# EasyEDA Pro project pcb工程文件.epro, schematic _bat-1
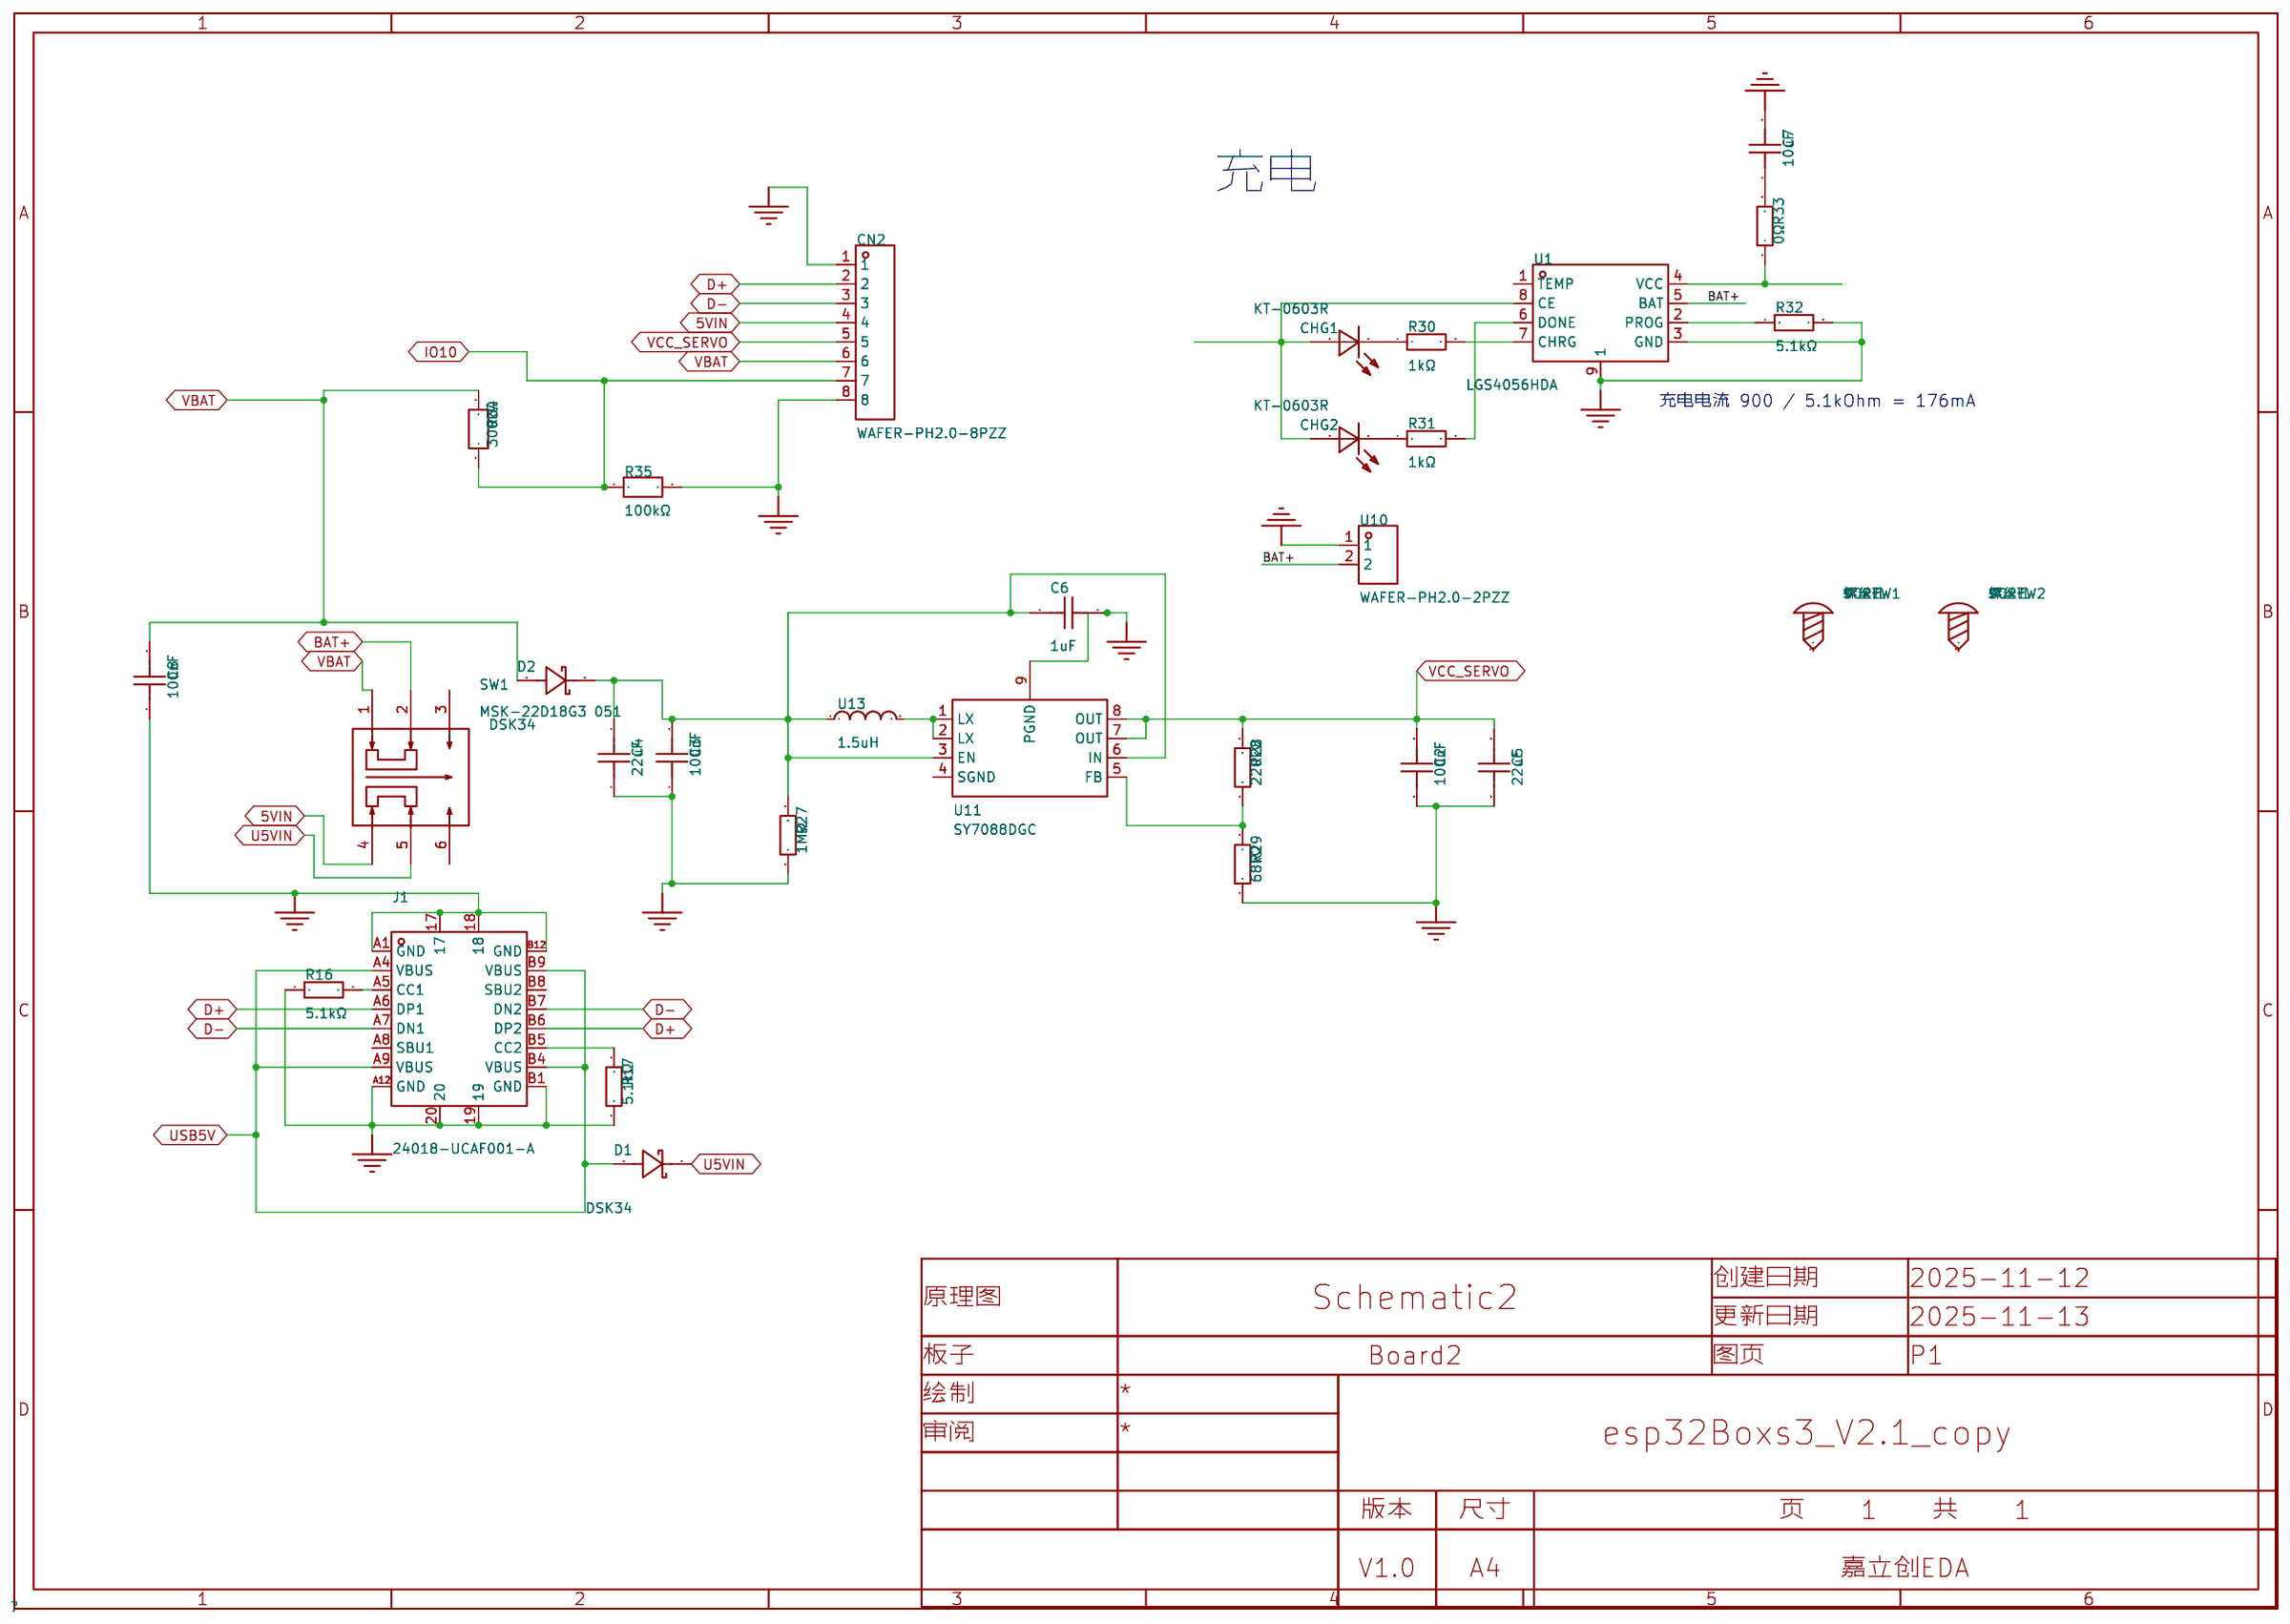
[diagram p1: schematic sheet]

## Parts
C2  100nF  [C0603]
C3  100nF  [C0603]
C4  22uF  [C0603]
C5  22uF  [C0603]
C6  1uF  [C0603]
C7  10uF  [C0603]
C8  100nF  [C0603]
CHG1  KT-0603R  [LED0603-RD]
CHG2  KT-0603R  [LED0603-RD]
CN2  WAFER-PH2.0-8PZZ  [CONN-TH_8P-P2.00_HDGC2001WV-8P]
D1  DSK34  [SOD-123FL_L2.7-W1.8-LS3.8-RD]
D2  DSK34  [SOD-123FL_L2.7-W1.8-LS3.8-RD]
J1  24018-UCAF001-A  [TYPE-C-USB-SMD_CF003]
R16  5.1kΩ  [R0603]
R17  5.1kΩ  [R0603]
R27  1MΩ  [R0603]
R28  220kΩ  [R0603]
R29  68kΩ  [R0603]
R30  1kΩ  [R0603]
R31  1kΩ  [R0603]
R32  5.1kΩ  [R0603]
R33  0Ω  [R0603]
R34  300kΩ  [R0603]
R35  100kΩ  [R0603]
SCREW1  螺丝孔  [M2螺丝]
SCREW2  螺丝孔  [M2螺丝]
SW1  MSK-22D18G3 051  [SW-TH_HX-MSK-22D18G3-051]
U1  LGS4056HDA  [DFN-8_L2.0-W2.0-P0.50-TL-EP1.6]
U10  WAFER-PH2.0-2PZZ  [CONN-TH_2P-P2.00_HC-PH-2A-M]
U11  SY7088DGC  [DFN-8_L3.0-W2.0-P0.50-BL-EP]
U13  1.5uH  [IND-SMD_L2.5-W2.0_FTC252010S]

## Library data of the parts
C2 C3 C8 = CC0603KRX7R9BB104: 容值:100nF;精度:±10%;额定电压:50V;温度系数:X7R;; LCSC Part Name: 100nF ±10% 50V; Supplier Part: C14663; Manufacturer: YAGEO(国巨); Supplier Footprint: 0603; JLCPCB Part Class: 基础库; Datasheet: https://item.szlcsc.com/datasheet/CC0603KRX7R9BB104/15331.html; Supplier: LCSC; Tolerance: ±10%; Voltage Rating: 50V; Temperature Coefficient: X7R
C4 C5 = CL10A226MQ8NRNC: 容值:22uF;精度:±20%;额定电压:6.3V;温度系数:X5R;; LCSC Part Name: 22uF ±20% 6.3V; Supplier Part: C59461; Manufacturer: SAMSUNG(三星); Supplier Footprint: 0603; JLCPCB Part Class: 基础库; Datasheet: https://item.szlcsc.com/datasheet/CL10A226MQ8NRNC/60514.html; Supplier: LCSC; Tolerance: ±20%; Voltage Rating: 6.3V; Temperature Coefficient: X5R
C6 = CL10A105KB8NNNC: 容值:1uF;精度:±10%;额定电压:50V;温度系数:X5R;; LCSC Part Name: 1uF ±10% 50V; Supplier Part: C15849; Manufacturer: SAMSUNG(三星); Supplier Footprint: 0603; JLCPCB Part Class: 基础库; Datasheet: https://item.szlcsc.com/datasheet/CL10A105KB8NNNC/16531.html; Supplier: LCSC; Tolerance: ±10%; Voltage Rating: 50V; Temperature Coefficient: X5R
C7 = CL10A106KP8NNNC: 容值:10uF;精度:±10%;额定电压:10V;温度系数:X5R;; LCSC Part Name: 10uF ±10% 10V; Supplier Part: C19702; Manufacturer: SAMSUNG(三星); Supplier Footprint: 0603; JLCPCB Part Class: 基础库; Datasheet: https://item.szlcsc.com/datasheet/CL10A106KP8NNNC/20411.html; Supplier: LCSC; Tolerance: ±10%; Voltage Rating: 10V; Temperature Coefficient: X5R
CHG1 CHG2 = KT-0603R: 发光颜色:红色;功率:-;正向电流:-;主波长:-;二极管配置:-;透镜颜色:-;色温:-;发光角度:-;载带方式:-;工作温度:-40℃~+85℃;; LCSC Part Name: 0603 红灯 高亮; Supplier Part: C2286; Manufacturer: KENTO; Supplier Footprint: 0603; JLCPCB Part Class: 基础库; Datasheet: https://atta.szlcsc.com/upload/public/pdf/source/20160616/1466072038404.pdf; Supplier: LCSC; Emitted Color: 红色; Operating Temperature: -40℃~+85℃
CN2 = WAFER-PH2.0-8PZZ: 插针结构:1x8P;间距:2mm;安装方式:直插;参考系列:PH;总PIN数:8P;排数:1;每排PIN数:8;行距:-;额定电流:2A;触头材质:黄铜;触头镀层:锡;工作温度:-25℃~+85℃;; LCSC Part Name: 1x8P 间距:2mm 直插 系列:PH; Supplier Part: C5359605; Manufacturer: XUNPU(讯普); Supplier Footprint: 插件,P=2mm; JLCPCB Part Class: 扩展库; Datasheet: https://atta.szlcsc.com/upload/public/pdf/source/20241108/09B74E94153224768C62B7F095CB8C18.pdf; Supplier: LCSC; Pins Structure: 1x8P; Pitch: 2mm; Mounting Type: 直插; Reference Series: PH; Number of Pins: 8P; Number of Rows: 1; Number of PINs Per Row: 8; Current Rating: 2A; Contact Material: 黄铜; Contact Plating: 锡; Operating Temperature: -25℃~+85℃; Voltage Rating: 250V; Plastic Material: PA66; Flame Retardant Rating: UL94V-0; Color: 白色; Z-Height of the Board: 6.05mm; X-Length of Bottom Edge on Board (Spacing Line): 18mm; Y-Width of Bottom Edge on Board: 4.7mm
D1 D2 = DSK34_C727076: 二极管配置:独立式;正向压降(Vf):520mV@3A;直流反向耐压(Vr):40V;整流电流:3A;; LCSC Part Name: 电压:40V 电流:3A; Supplier Part: C727076; Manufacturer: TWGMC(迪嘉); Supplier Footprint: SOD-123FL; JLCPCB Part Class: 扩展库; Datasheet: https://item.szlcsc.com/datasheet/DSK34/774181.html; Supplier: LCSC; Diode Configuration: 独立式; Voltage - Forward(Vf@If): 520mV@3A; Voltage - DC Reverse(Vr): 40V; Current - Rectified: 3A; Reverse Leakage Current (Ir): 500uA; Operating Junction Temperature Range: -55℃~+125℃; Non-Repetitive Peak Forward Surge Current: 80A
J1 = 24018-UCAF001-A: Supplier Part: C3148202; Manufacturer: MINTRON(明硕); Supplier Footprint: SMD; JLCPCB Part Class: 扩展库; Datasheet: https://item.szlcsc.com/datasheet/24018-UCAF001-A/3708443.html; Supplier: LCSC
R16 R17 R32 = 0603WAF5101T5E: 电阻类型:厚膜电阻;阻值:5.1kΩ;精度:±1%;功率:100mW;工作电压:75V;温度系数:±100ppm/℃;; LCSC Part Name: 5.1kΩ ±1% 100mW 厚膜电阻; Supplier Part: C23186; Manufacturer: UNI-ROYAL(厚声); Supplier Footprint: 0603; JLCPCB Part Class: 基础库; Datasheet: https://item.szlcsc.com/datasheet/0603WAF5101T5E/23913.html; Supplier: LCSC; Type: 厚膜电阻; Tolerance: ±1%; Power(Watts): 100mW; Voltage-Supply(Max): 75V; Temperature Coefficient: ±100ppm/℃; Operating Temperature: -55℃~+155℃
R27 = 0603WAF1004T5E: 电阻类型:厚膜电阻;阻值:1MΩ;精度:±1%;功率:100mW;最大工作电压:75V;温度系数:±100ppm/℃;; LCSC Part Name: 1MΩ ±1% 100mW 厚膜电阻; Supplier Part: C22935; Manufacturer: UNI-ROYAL(厚声); Supplier Footprint: 0603; JLCPCB Part Class: 基础库; Datasheet: https://atta.szlcsc.com/upload/public/pdf/source/20200306/C422600_1E6D84923E4A46A82E41ADD87F860B5C.pdf; Supplier: LCSC; Type: 厚膜电阻; Tolerance: ±1%; Power(Watts): 100mW; Overload Voltage (Max): 75V; Temperature Coefficient: ±100ppm/℃; Operating Temperature Range: -55℃~+155℃
R28 = 0603WAF2203T5E: 电阻类型:厚膜电阻;阻值:220kΩ;精度:±1%;功率:100mW;工作电压:75V;温度系数:±100ppm/℃;; LCSC Part Name: 220kΩ ±1% 100mW 厚膜电阻; Supplier Part: C22961; Manufacturer: UNI-ROYAL(厚声); Supplier Footprint: 0603; JLCPCB Part Class: 基础库; Datasheet: https://item.szlcsc.com/datasheet/0603WAF2203T5E/23688.html; Supplier: LCSC; Type: 厚膜电阻; Tolerance: ±1%; Power(Watts): 100mW; Voltage-Supply(Max): 75V; Temperature Coefficient: ±100ppm/℃; Operating Temperature: -55℃~+155℃
R29 = 0603WAF6802T5E: 电阻类型:厚膜电阻;阻值:68kΩ;精度:±1%;功率:100mW;工作电压:75V;温度系数:±100ppm/℃;; LCSC Part Name: 68kΩ ±1% 100mW 厚膜电阻; Supplier Part: C23231; Manufacturer: UNI-ROYAL(厚声); Supplier Footprint: 0603; JLCPCB Part Class: 基础库; Datasheet: https://item.szlcsc.com/datasheet/0603WAF6802T5E/23958.html; Supplier: LCSC; Type: 厚膜电阻; Tolerance: ±1%; Power(Watts): 100mW; Voltage-Supply(Max): 75V; Temperature Coefficient: ±100ppm/℃; Operating Temperature: -55℃~+155℃
R30 R31 = 0603WAF1001T5E: 电阻类型:厚膜电阻;阻值:1kΩ;精度:±1%;功率:100mW;最大工作电压:75V;温度系数:±100ppm/℃;; LCSC Part Name: 1kΩ ±1% 100mW 厚膜电阻; Supplier Part: C21190; Manufacturer: UNI-ROYAL(厚声); Supplier Footprint: 0603; JLCPCB Part Class: 基础库; Datasheet: https://atta.szlcsc.com/upload/public/pdf/source/20200306/C422600_1E6D84923E4A46A82E41ADD87F860B5C.pdf; Supplier: LCSC; Type: 厚膜电阻; Tolerance: ±1%; Power(Watts): 100mW; Overload Voltage (Max): 75V; Temperature Coefficient: ±100ppm/℃; Operating Temperature Range: -55℃~+155℃
R33 = 0603WAF0000T5E: 电阻类型:厚膜电阻;阻值:0Ω;精度:±1%;功率:100mW;工作电压:75V;温度系数:-;; LCSC Part Name: 0Ω ±1% 100mW 厚膜电阻; Supplier Part: C21189; Manufacturer: UNI-ROYAL(厚声); Supplier Footprint: 0603; JLCPCB Part Class: 基础库; Datasheet: https://item.szlcsc.com/datasheet/0603WAF0000T5E/21903.html; Supplier: LCSC; Type: 厚膜电阻; Tolerance: ±1%; Power(Watts): 100mW; Voltage-Supply(Max): 75V; Operating Temperature: -55℃~+155℃
R34 = CRCW0603300KFKEA: 电阻类型:厚膜电阻;阻值:300kΩ;精度:±1%;功率:100mW;工作电压:100V;温度系数:±100ppm/℃;; LCSC Part Name: 厚膜电阻 300kΩ ±1% 100mW; Supplier Part: C844772; Manufacturer: VISHAY(威世); Supplier Footprint: 0603; JLCPCB Part Class: 扩展库; Datasheet: https://item.szlcsc.com/datasheet/CRCW0603300KFKEA/904346.html; Supplier: LCSC; Type: 厚膜电阻; Tolerance: ±1%; Power(Watts): 100mW; Voltage-Supply(Max): 100V; Temperature Coefficient: ±100ppm/℃; Operating Temperature: -55℃~+155℃
R35 = CRCW0603100KFKEA: 电阻类型:厚膜电阻;阻值:100kΩ;精度:±1%;功率:100mW;最大工作电压:75V;温度系数:±100ppm/℃;; LCSC Part Name: 厚膜电阻 100kΩ ±1% 100mW; Supplier Part: C844916; Manufacturer: VISHAY(威世); Supplier Footprint: 0603; JLCPCB Part Class: 扩展库; Datasheet: https://atta.szlcsc.com/upload/public/pdf/source/20200927/C844919_23E7F5DF28E9421F105631C5C2D28736.pdf; Supplier: LCSC; Type: 厚膜电阻; Tolerance: ±1%; Power(Watts): 100mW; Overload Voltage (Max): 75V; Temperature Coefficient: ±100ppm/℃; Operating Temperature Range: -55℃~+155℃
SCREW1 SCREW2 = 螺丝孔: Supplier Footprint: 插件
SW1 = MSK-22D18G3_051: 电路结构:双刀双掷;安装方式:弯插;额定电流:100mA;额定电压:12V;工作寿命:1万次;; LCSC Part Name: 两档卧式插件 6脚拨动 柄长3MM; Supplier Part: C7507432; Manufacturer: SHOU HAN(首韩); Supplier Footprint: DIP; JLCPCB Part Class: 扩展库; Datasheet: https://item.szlcsc.com/datasheet/MSK-22D18G3%2520051/8598454.html; Supplier: LCSC; Circuit: 双刀双掷; Actuator Style: 矩形柱状; Termination Style: PC引脚; Mounting Type: 弯插; Current Rating: 100mA; Voltage Rating: 12V; Life: 1万次; Operating Temperature: -10℃~+50℃
U1 = LGS4056H: 电源电压:4V~6V;最大充电电流:1A;电池类型:锂离子/聚合物;电池节数:1;; LCSC Part Name: TP4056H(DFN); Supplier Part: C5124109; Manufacturer: Legend-Si(棱晶半导体); Supplier Footprint: DFN-8(2x2); JLCPCB Part Class: 扩展库; Datasheet: https://atta.szlcsc.com/upload/public/pdf/source/20230407/EF281A5928E4D64337F5505487E44644.pdf; Supplier: LCSC; The Chip Type: 线性充电芯片; Supply Voltage: 4V~6V; Maximum Charge Current: 1A; Charging Saturation Voltage: 4.2V; Type of Battery: 锂离子/聚合物; Number of Cells: 1; Operating Temperature: -40℃~+125℃
U10 = WAFER-PH2.0-2PZZ: 插针结构:1x2P;间距:2mm;安装方式:直插;参考系列:PH;总PIN数:2P;排数:1;每排PIN数:2;行距:-;额定电流:2A;触头材质:黄铜;触头镀层:锡;工作温度:-25℃~+85℃;; LCSC Part Name: 1x2P 间距:2mm 直插 系列:PH; Supplier Part: C5359599; Manufacturer: XUNPU(讯普); Supplier Footprint: 插件,P=2mm; JLCPCB Part Class: 扩展库; Datasheet: https://atta.szlcsc.com/upload/public/pdf/source/20241108/09B74E94153224768C62B7F095CB8C18.pdf; Supplier: LCSC; Pins Structure: 1x2P; Pitch: 2mm; Mounting Type: 直插; Reference Series: PH; Number of Pins: 2P; Number of Rows: 1; Number of PINs Per Row: 2; Current Rating: 2A; Contact Material: 黄铜; Contact Plating: 锡; Operating Temperature: -25℃~+85℃; Voltage Rating: 250V; Plastic Material: PA66; Flame Retardant Rating: UL94V-0; Color: 白色; Z-Height of the Board: 6.05mm; X-Length of Bottom Edge on Board (Spacing Line): 6mm; Y-Width of Bottom Edge on Board: 4.7mm
U11 = SY7088DGC: 功能类型:升压型;输出类型:可调;工作电压:2.3V~5.25V;输出电压:2.5V~5.5V;输出电流:3A;; LCSC Part Name: 高效同步升压调节器; Supplier Part: C178240; Manufacturer: Silergy(矽力杰); Supplier Footprint: DFN-8-EP(2x3); JLCPCB Part Class: 扩展库; Datasheet: https://item.szlcsc.com/datasheet/SY7088DGC/189632.html; Supplier: LCSC; Function: 升压型; Output Type: 可调; Voltage - Supply: 2.3V~5.25V; Output Voltage: 2.5V~5.5V; Output Current: 3A; Frequency - Switching: 1MHz; Operating Temperature: -40℃~+85℃@(TA); Synchronous Rectifier: 是; Number of Outputs: 1; Topology: 升压式; Quiescent Current: 2uA; Switch tube (built-in/external): 内置
U13 = FTC252010S1R5MBCA: 电感值:1.5uH;精度:±20%;额定电流:3.4A;饱和电流(Isat):4.3A;类型:一体成型电感;; LCSC Part Name: 1.5uH ±20% 4.3A; Supplier Part: C5832357; Manufacturer: cjiang(长江微电); Supplier Footprint: SMD,2x2.5mm; JLCPCB Part Class: 扩展库; Datasheet: https://atta.szlcsc.com/upload/public/pdf/source/20230602/8FFEDA9C0247A92A0D4B67554BFE4091.pdf; Supplier: LCSC; Tolerance: ±20%; Rated Current: 3.4A; Saturation Current (Isat): 4.3A; DC Resistance (DCR): 45mΩ; Type: 一体成型电感

## Nets
5VIN: CN2.4 SW1.4
GND: C2.1 C3.1 C4.1 C5.1 C6.2 C7.2 C8.1 CN2.1 CN2.8 J1.17 J1.18 J1.19 J1.20 J1.A1(GND) J1.A12(GND) J1.B1(GND) J1.B12(GND) R16.1 R17.1 R27.1 R29.1 R32.2 R35.2 U1.3(GND) U1.9(1) U10.1 U11.9(PGND)
VBAT: C8.2 CN2.6 D2.2(A) R34.2 SW1.1
VCC_SERVO: C2.2 C5.2 CN2.5 R28.2 U11.7(OUT) U11.8(OUT)
$$$1: R28.1 R29.2 U11.5(FB)
$$$2: U11.1(LX) U11.2(LX) U13.2
$$$3: C3.2 C4.2 C6.1 D2.1(K) R27.2 U11.3(EN) U11.6(IN) U13.1
$$$4: R30.2 U1.7(CHRG)
$$$5: R32.1 U1.2(PROG)
$$$6: R31.2 U1.6(DONE)
$$$7: J1.B5(CC2) R17.2
$$$8: J1.A5(CC1) R16.2
$$$9: CHG1.1(K) R30.1
$$$10: CHG2.1(K) R31.1
$$$11: C7.1 R33.2
BAT+: SW1.2 U1.5(BAT) U10.2
D+: CN2.2 J1.A6(DP1) J1.B6(DP2)
D-: CN2.3 J1.A7(DN1) J1.B7(DN2)
IO10: CN2.7 R34.1 R35.1
U5VIN: D1.1(K) SW1.5
USB5V: CHG1.2(A) CHG2.2(A) D1.2(A) J1.A4(VBUS) J1.A9(VBUS) J1.B4(VBUS) J1.B9(VBUS) R33.1 U1.4(VCC) U1.8(CE)

Not connected (* = marked no-connect by the designer): J1 A8(SBU1) B8(SBU2); SCREW1 1; SCREW2 1; SW1 3 6; U1 1(TEMP); U11 4(SGND)

## Notes on the sheet
- 充电
- 充电电流 900 / 5.1kOhm = 176mA
